# EAGLE design snes_visualization_right (EAGLE 6.4)
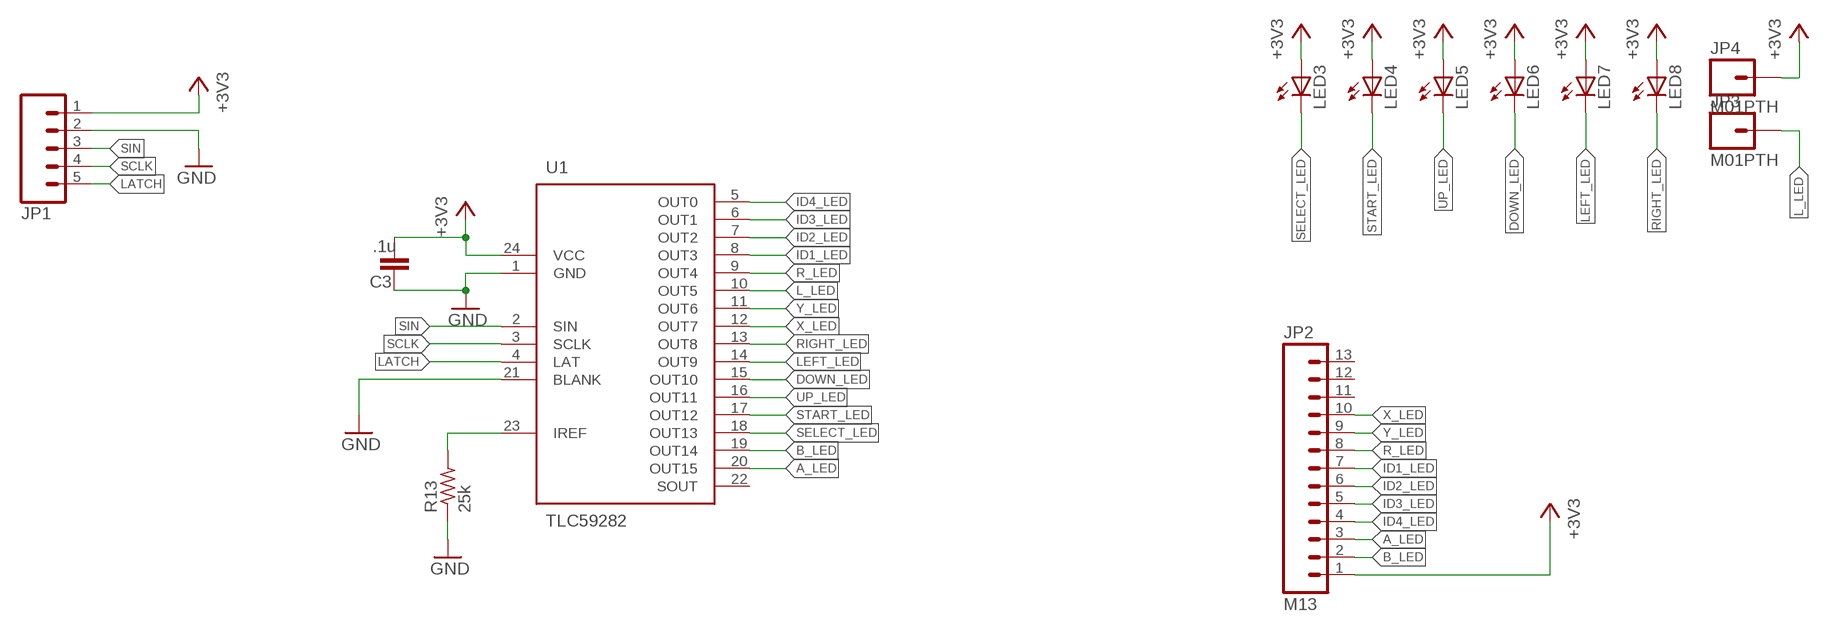
[diagram p0: schematic, sheet 1]

## Parts
C3  .1u  C-EUC0603  [C0603]
JP1  M05PTH  [1X05]
JP2  M13  [1X13]
JP3  M01PTH  [1X01]
JP4  M01PTH  [1X01]
LED3  LED3MM  [LED3MM]
LED4  LED3MM  [LED3MM]
LED5  LED5MM  [LED5MM]
LED6  LED5MM  [LED5MM]
LED7  LED5MM  [LED5MM]
LED8  LED5MM  [LED5MM]
R13  25k  R-US_R0805  [R0805]
U1  TLC59282  [R-PDSO-G24]

## Nets
+3V3: C3.1 JP1.1 JP2.1 JP4.1 LED3.A LED4.A LED5.A LED6.A LED7.A LED8.A U1.24(VCC)
A_LED: JP2.3 U1.20(OUT15)
B_LED: JP2.2 U1.19(OUT14)
DOWN_LED: LED6.K(C) U1.15(OUT10)
GND: C3.2 JP1.2 R13.1 U1.1(GND) U1.21(BLANK)
ID1_LED: JP2.7 U1.8(OUT3)
ID2_LED: JP2.6 U1.7(OUT2)
ID3_LED: JP2.5 U1.6(OUT1)
ID4_LED: JP2.4 U1.5(OUT0)
L_LED: JP3.1 U1.10(OUT5)
LATCH: JP1.5 U1.4(LAT)
LEFT_LED: LED7.K(C) U1.14(OUT9)
N$5: R13.2 U1.23(IREF)
R_LED: JP2.8 U1.9(OUT4)
RIGHT_LED: LED8.K(C) U1.13(OUT8)
SCLK: JP1.4 U1.3(SCLK)
SELECT_LED: LED3.K(C) U1.18(OUT13)
SIN: JP1.3 U1.2(SIN)
START_LED: LED4.K(C) U1.17(OUT12)
UP_LED: LED5.K(C) U1.16(OUT11)
X_LED: JP2.10 U1.12(OUT7)
Y_LED: JP2.9 U1.11(OUT6)
Unconnected: JP2.11 JP2.12 JP2.13 U1.22(SOUT)

## Library data of the parts
C3 = rcl:C-EU: CAPACITOR, European symbol; MOUSER#: 80-C0603C104K5R
JP1 = SparkFun-Connectors:M05: Header 5 Standard 5-pin 0.1" header. Use with straight break away headers (SKU : PRT-00116), right angle break away headers (PRT-00553), swiss pins (PRT-00743), machine pins (PRT-00117), and female headers (PRT-00115). Molex polarized connector foot print use with SKU : PRT-08230 with associated crimp pins and housings.
JP2 = SparkFun-Connectors:M13: 13-pin single row .1" header
JP3 JP4 = SparkFun-Connectors:M01: Header 1 Standard 1-pin 0.1" header. Use with straight break away headers (SKU : PRT-00116), right angle break away headers (PRT-00553), swiss pins (PRT-00743), machine pins (PRT-00117), and female headers (PRT-00115).
LED3-LED8 = led:LED: LED OSRAM: - CHIPLED LG R971, LG N971, LY N971, LG Q971, LY Q971, LO R971, LY R971 LH N974, LH R974 LS Q976, LO Q976, LY Q976 LO Q996 - Hyper CHIPLED LW Q18S LB Q993, LB Q99A, LB R99A - SideLED LS A670, LO A670, LY A670, LG A670, LP A670 LB A673, LV A673, LT A673, LW A673 LH A674 LY A675 LS A676, LA A676, LO A676, LY A676, LW A676 LS A679, LY A679, LG A679 - Hyper Micro SIDELED® LS Y876, LA Y876, LO Y876, LY Y876 LT Y87S - SmartLED LW L88C, LW L88S LB L89C, LB L89S, LG L890 LS L89K, LO L89K, LY L89K LS L896, LA L896, LO L896, LY L896 - TOPLED LS T670, LO T670, LY T670, LG T670, LP T670 LSG T670, LSP T670, LSY T670, LOP T670, LYG T670 LG T671, LOG T671, LSG T671 LB T673, LV T673, LT T673, LW T673 LH T674 LS T676, LA T676, LO T676, LY T676, LB T676, LH T676, LSB T676, LW T676 LB T67C, LV T67C, LT T67C, LS T67K, LO T67K, LY T67K, LW E67C LS E67B, LA E67B, LO E67B, LY E67B, LB E67C, LV E67C, LT E67C LW T67C LS T679, LY T679, LG T679 LS T770, LO T770, LY T770, LG T770, LP T770 LB T773, LV T773, LT T773, LW T773 LH T774 LS E675, LA E675, LY E675, LS T675 LS T776, LA T776, LO T776, LY T776, LB T776 LHGB T686 LT T68C, LB T68C - Hyper Mini TOPLED® LB M676 - Mini TOPLED Santana® LG M470 LS M47K, LO M47K, LY M47K Source: http://www.osram.convergy.de LUXEON: - LUMILED® LXK2-PW12-R00, LXK2-PW12-S00, LXK2-PW14-U00, LXK2-PW14-V00 LXK2-PM12-R00, LXK2-PM12-S00, LXK2-PM14-U00 LXK2-PE12-Q00, LXK2-PE12-R00, LXK2-PE12-S00, LXK2-PE14-T00, LXK2-PE14-U00 LXK2-PB12-K00, LXK2-PB12-L00, LXK2-PB12-M00, LXK2-PB14-N00, LXK2-PB14-P00, LXK2-PB14-Q00 LXK2-PR12-L00, LXK2-PR12-M00, LXK2-PR14-Q00, LXK2-PR14-R00 LXK2-PD12-Q00, LXK2-PD12-R00, LXK2-PD12-S00 LXK2-PH12-R00, LXK2-PH12-S00 LXK2-PL12-P00, LXK2-PL12-Q00, LXK2-PL12-R00 Source: www.luxeon.com KINGBRIGHT: KA-3528ASYC Source: www.kingbright.com
R13 = rcl:R-US_: RESISTOR, American symbol
U1 = TASLink:TLC59282

## Board
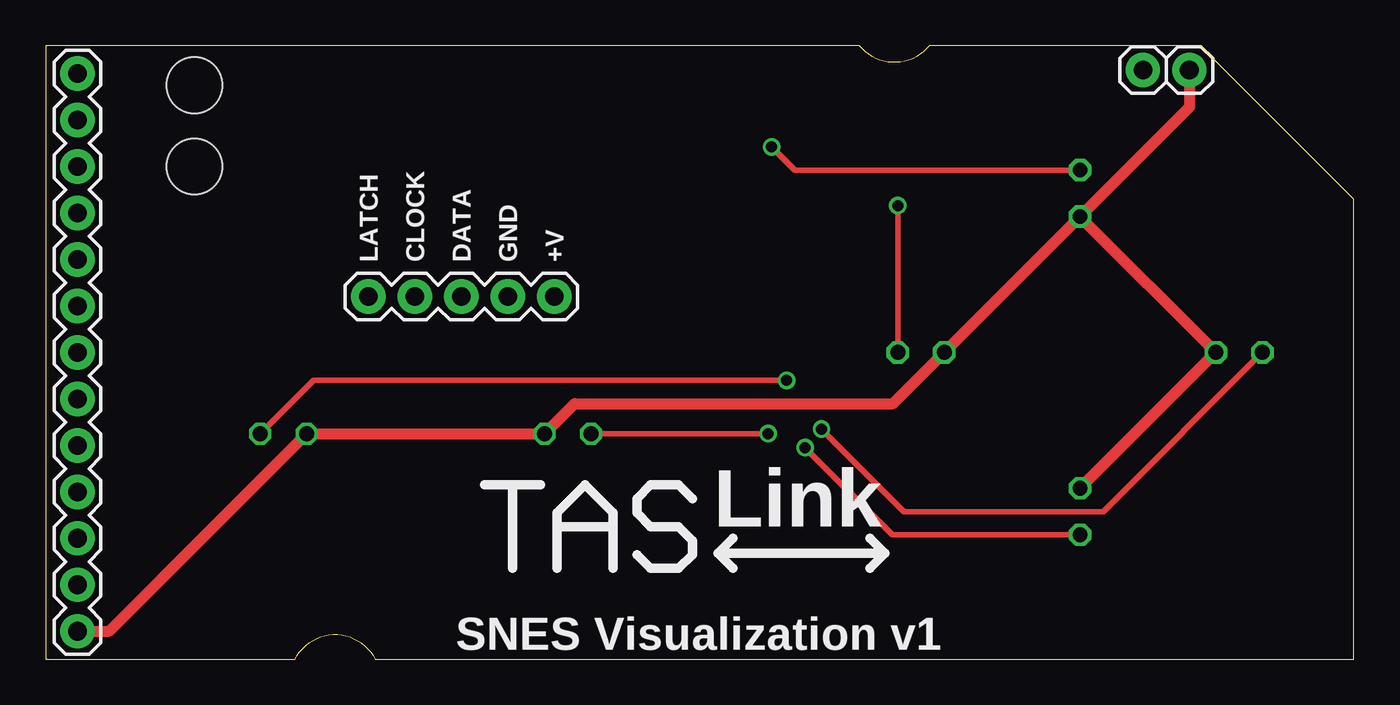
[diagram p1: board, top side]
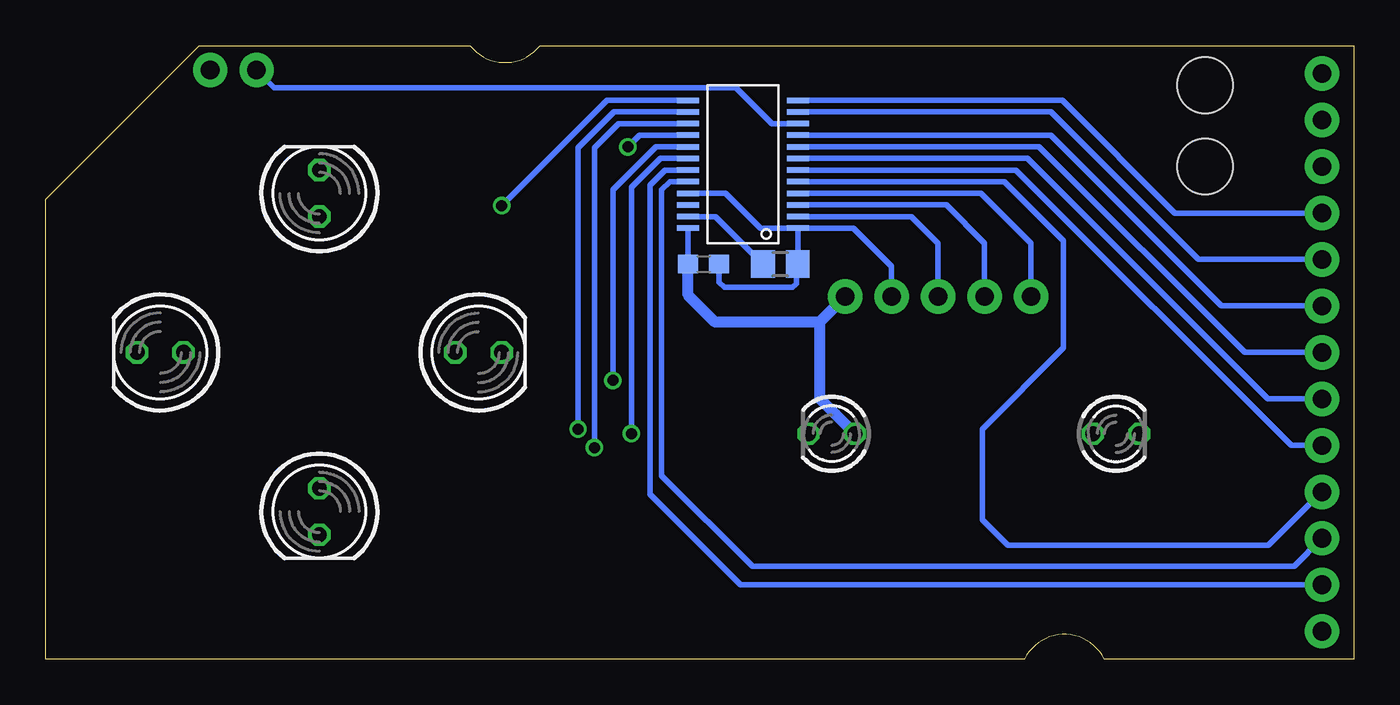
[diagram p2: board, bottom side, seen from below]

Size 71.53 x 33.53 mm. Coordinates in mm from the lower left corner, seen from the top.
Outline: 0,33.53 0,0 13.64,0 arc-127 18.01,0 71.53,0 71.53,25.15 63.14,33.53 48.31,33.53 arc-103 44.5,33.53 0,33.53
Copper layers (1*16): Top 0.0356mm / dielectric 1.5011mm / Bottom 0.0356mm
Design rules "LaenPCBOrder *": minimum track width 6mil, minimum drill 13mil, track to track 6mil, track to pad 6mil, pad to pad 6mil, via to via 6mil, smd to smd 6mil, copper to edge 15mil, drill to drill 6mil, minimum pad ring 7mil, minimum via ring 7mil, stop-mask expansion 3mil, vias tented up to drill 24mil, thermal gap 10mil
Holes 3.05 mm at 8.13,31.37 8.13,26.92

### Footprints (pad centres in the part's own frame; a part is rotated, then mirrored left to right if it is on the bottom)
C0603 = smd 1.1 x 1: 1 -0.85,0; 2 0.85,0
1X05 = drill 1.016 pad 1.88: 1 0,0; 2 2.54,0; 3 5.08,0; 4 7.62,0; 5 10.16,0
1X13 = drill 1.016 pad 1.88: 1 0,0; 2 2.54,0; 3 5.08,0; 4 7.62,0; 5 10.16,0; 6 12.7,0; 7 15.24,0; 8 17.78,0; 9 20.32,0; 10 22.86,0; 11 25.4,0; 12 27.94,0; 13 30.48,0
1X01 = drill 1.016 pad 1.88: 1 0,0
LED3MM = drill 0.813 octagon: A -1.27,0; K 1.27,0
LED5MM = drill 0.813 octagon: A -1.27,0; K 1.27,0
R0805 = smd 1.3 x 1.5: 1 -0.95,0; 2 0.95,0
R-PDSO-G24 = smd 0.3 x 1.2: 1 -3.493,-3; 2 -2.857,-3; 3 -2.223,-3; 4 -1.587,-3; 5 -0.953,-3; 6 -0.318,-3; 7 0.318,-3; 8 0.953,-3; 9 1.587,-3; 10 2.223,-3; 11 2.857,-3; 12 3.493,-3; 13 3.493,3; 14 2.857,3; 15 2.223,3; 16 1.587,3; 17 0.953,3; 18 0.318,3; 19 -0.318,3; 20 -0.953,3; 21 -1.587,3; 22 -2.223,3; 23 -2.857,3; 24 -3.493,3

### Placement (x,y rotation side)
C3  35.55,21.59 0 bottom
JP1  27.81,19.81 180 top
JP2  1.74,1.52 90 top
JP3  59.99,32.21 0 top
JP4  62.53,32.21 0 top
LED3  28.55,12.32 180 bottom
LED4  13,12.32 0 bottom
LED5  56.56,25.46 90 bottom
LED6  56.56,8.06 270 bottom
LED7  65.26,16.76 180 bottom
LED8  47.86,16.76 0 bottom
R13  31.35,21.59 180 bottom
U1  33.4,27.05 90 bottom

### Tracks (layer width: path | path; a pad name or v marks a point on that pad's centre or on a via)
+3V3
  Top 0.61: LED5.A LED8.A 46.34,13.97 28.93,13.97 LED3.A LED4.A 3.48,1.52 JP2.1 | LED6.A LED7.A LED5.A | JP4.1 62.53,30.17 LED5.A
  Bottom 0.305: LED8.A 49.13,16.91 | U1.24 C3.1
  Bottom 0.61: 27.28,12.35 LED3.A 29.21,14.25 29.21,18.41 | JP1.1 29.21,18.41 | 29.21,18.41 34.92,18.41 36.4,19.89 C3.1
A_LED
  Bottom 0.305: U1.20 37.4,26.1 37.85,25.65 37.85,10.03 32.89,5.08 3.26,5.08 JP2.3
B_LED
  Bottom 0.305: U1.19 37.66,26.73 38.48,25.91 38.48,9.02 33.53,4.06 JP2.2
DOWN_LED  (via drill 0.6)
  Top 0.305: v41.53,11.56 46.29,6.79 LED6.K
  Bottom 0.305: U1.15 40.2,29.27 41.53,27.94 v41.53,11.56
GND
  Bottom 0.305: JP1.2 25.27,21.46 27.37,23.56 U1.1 | U1.1 R13.1 30.48,21.51 30.48,20.52 30.68,20.32 34.42,20.32 34.7,20.6 C3.2 | U1.21 34.35,25.46 32.45,23.56 U1.1
ID1_LED
  Bottom 0.305: JP2.7 5.97,16.76 17.21,28 U1.8
ID2_LED
  Bottom 0.305: JP2.6 4.7,14.22 17.84,27.37 U1.7
ID3_LED
  Bottom 0.305: JP2.5 3.43,11.68 18.48,26.73 U1.6
ID4_LED
  Bottom 0.305: U1.5 19.11,26.1 15.88,22.86 15.88,17.02 20.32,12.57 20.32,7.62 18.92,6.22 4.66,6.22 JP2.4
L_LED
  Bottom 0.305: U1.10 31.81,29.27 33.78,31.24 59.03,31.24 JP3.1
LATCH
  Bottom 0.305: JP1.5 17.65,22.73 20.38,25.46 U1.4
LEFT_LED  (via drill 0.6)
  Top 0.305: v42.42,12.57 46.93,8.06 57.83,8.06 LED7.K
  Bottom 0.305: U1.14 40.45,29.91 42.42,27.94 v42.42,12.57
N$5
  Bottom 0.305: R13.2 34.9,24.19 U1.23
R_LED
  Bottom 0.305: JP2.8 7.24,19.3 16.57,28.64 U1.9
RIGHT_LED  (via drill 0.6)
  Top 0.305: LED8.K v46.59,24.78
  Bottom 0.305: U1.13 40.83,30.54 v46.59,24.78
SCLK
  Bottom 0.305: JP1.4 20.19,22.73 22.29,24.83 U1.3
SELECT_LED  (via drill 0.6)
  Top 0.305: v39.5,12.32 LED3.K
  Bottom 0.305: v39.5,12.32 39.5,25.78 37.91,27.37 U1.18
SIN
  Bottom 0.305: JP1.3 22.73,22.73 24.19,24.19 U1.2
START_LED  (via drill 0.6)
  Top 0.305: LED4.K 14.65,15.24 v40.51,15.24
  Bottom 0.305: v40.51,15.24 40.51,25.65 38.16,28 U1.17
UP_LED  (via drill 0.6)
  Top 0.305: v39.69,28 40.96,26.73 LED5.K
  Bottom 0.305: U1.16 39.05,28.64 v39.69,28
X_LED
  Bottom 0.305: JP2.10 9.78,24.38 15.94,30.54 U1.12
Y_LED
  Bottom 0.305: JP2.9 8.51,21.84 16.57,29.91 U1.11

### Text on the board
tPlace: LATCH | CLOCK | DATA | GND | +V | Link | SNES Visualization v1